# Altium schematic sheet ESP32.SchDoc: WiFi Bluetooth and Peripheral (part 1 of 2)
size A3; DrawnBy: Manh Ngo Van; Engineer: Manh Ngo Van; Organization: Altium Limited; Address1: L3, 12a Rodborough Rd; Address2: Frenchs Forest; Address3: NSW; Address4: Australia 2086; DocumentNumber: 3; Revision: 1.0; SheetNumber: 3; SheetTotal: 3
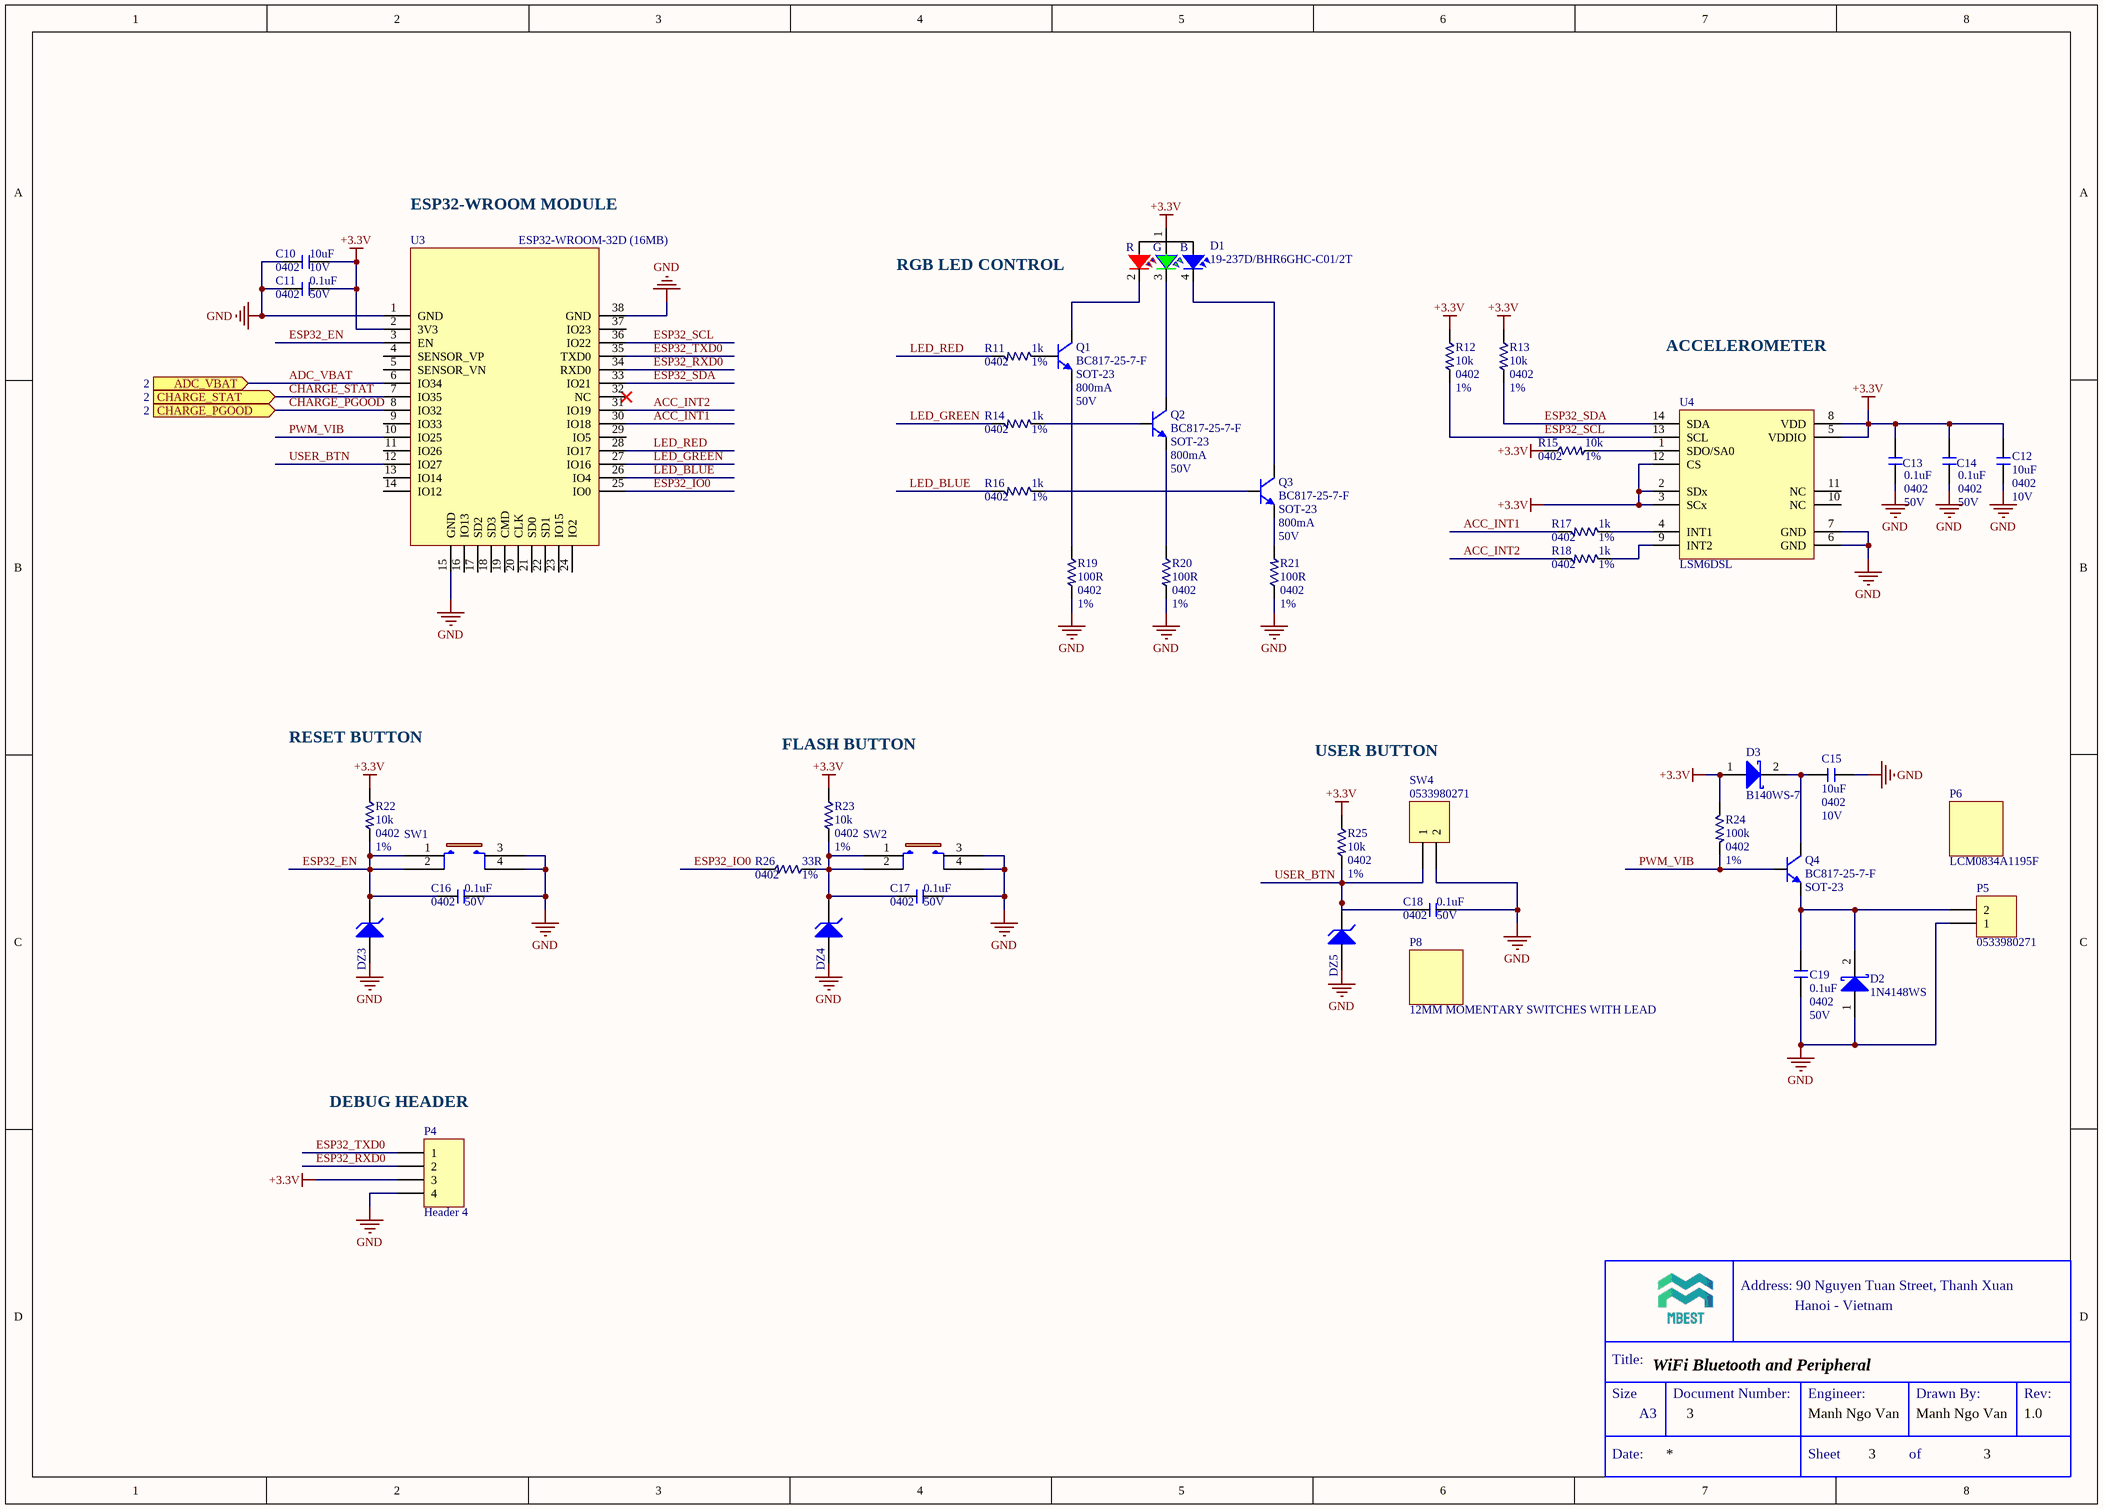
[diagram p0: ESP32.SchDoc]

## Parts
C10  10uF  Case/Package: 0402  Voltage Rating: 10V  [C0402M]
C11  0.1uF  Case/Package: 0402  Voltage: 50V  [C0402M]
C12  10uF  Case/Package: 0402  Voltage Rating: 10V  [C0402M]
C13  0.1uF  Case/Package: 0402  Voltage: 50V  [C0402M]
C14  0.1uF  Case/Package: 0402  Voltage: 50V  [C0402M]
C15  10uF  Case/Package: 0402  Voltage Rating: 10V  [C0402M]
C16  0.1uF  Case/Package: 0402  Voltage: 50V  [C0402M]
C17  0.1uF  Case/Package: 0402  Voltage: 50V  [C0402M]
C18  0.1uF  Case/Package: 0402  Voltage: 50V  [C0402M]
C19  0.1uF  Case/Package: 0402  Voltage: 50V  [C0402M]
D1  19-237D/BHR6GHC-C01/2T  [19-237D/BHR6GHC-C01/2T]
D2  1N4148WS  [SODFL250X70-2N]
D3  B140WS-7  [SODFL250X70-2N]
DZ3  TPD1E10B06DPYR  [R0402M]  (value not drawn)
DZ4  TPD1E10B06DPYR  [R0402M]  (value not drawn)
DZ5  TPD1E10B06DPYR  [R0402M]  (value not drawn)
P4  Header 4  [HDR1X4]
P5  0533980271  [0533980271]  (no BOM)
P6  LCM0834A1195F  (mechanical)
P8  12MM MOMENTARY SWITCHES WITH LEAD  (mechanical)
Q1  BC817-25-7-F  Case/Package: SOT-23  Max Collector Current: 800mA  Collector Base Voltage (VCBO): 50V  [SOT95P245X110-3N]
Q2  BC817-25-7-F  Case/Package: SOT-23  Max Collector Current: 800mA  Collector Base Voltage (VCBO): 50V  [SOT95P245X110-3N]
Q3  BC817-25-7-F  Case/Package: SOT-23  Max Collector Current: 800mA  Collector Base Voltage (VCBO): 50V  [SOT95P245X110-3N]
Q4  BC817-25-7-F  Case/Package: SOT-23  [SOT95P245X110-3N]
R11  1k  Case/Package: 0402  Tolerance: 1%  [R0402M]
R12  10k  Case Code (Imperial): 0402  Tolerance: 1%  [R0402M]
R13  10k  Case Code (Imperial): 0402  Tolerance: 1%  [R0402M]
R14  1k  Case/Package: 0402  Tolerance: 1%  [R0402M]
R15  10k  Case Code (Imperial): 0402  Tolerance: 1%  [R0402M]
R16  1k  Case/Package: 0402  Tolerance: 1%  [R0402M]
R17  1k  Case/Package: 0402  Tolerance: 1%  [R0402M]
R18  1k  Case/Package: 0402  Tolerance: 1%  [R0402M]
R19  100R  Case Code (Imperial): 0402  Tolerance: 1%  [R0402M]
R20  100R  Case Code (Imperial): 0402  Tolerance: 1%  [R0402M]
R21  100R  Case Code (Imperial): 0402  Tolerance: 1%  [R0402M]
R22  10k  Case Code (Imperial): 0402  Tolerance: 1%  [R0402M]
R23  10k  Case Code (Imperial): 0402  Tolerance: 1%  [R0402M]
R24  100k  Case/Package: 0402  Tolerance: 1%  [R0402M]
R25  10k  Case Code (Imperial): 0402  Tolerance: 1%  [R0402M]
R26  33R  Size Code: 0402  Tolerance: 1%  [R0402M]
SW1  PTS810SJK250SMTRLFS  [PTS810SJG250SMTRLFS]  (value not drawn)
SW2  PTS810SJK250SMTRLFS  [PTS810SJG250SMTRLFS]  (value not drawn)
SW4  0533980271  [0533980271]  (no BOM)
U3  ESP32-WROOM-32D (16MB)  [ESP32S]
U4  LSM6DSL  [LSM6DSL]

## Ports
ADC_VBAT (in, see 2), CHARGE_PGOOD (in, see 2), CHARGE_STAT (in, see 2)

## Nets
+3.3V: C10.2 C11.2 C12.2 C13.2 C14.2 D1.1(ANODE) D3.1(A) P4.3 R12.2 R13.2 R15.2 R22.2 R23.2 R24.2 R25.2 U3.2(3V3) U4.2(SDx) U4.3(SCx) U4.5(VDDIO) U4.8(VDD) U4.12(CS)
GND: C10.1 C11.1 C12.1 C13.1 C14.1 C15.1 C16.2 C17.2 C18.2 C19.1 D2.1(A) DZ3.1(A) DZ4.1(A) DZ5.1(A) P4.4 P5.1 R19.1 R20.1 R21.2 SW1.3 SW1.4 SW2.3 SW2.4 SW4.2 U3.1(GND) U3.15(GND) U3.38(GND) U4.6(GND) U4.7(GND)
ACC_INT1: R17.1 U3.30(IO18)
ACC_INT2: R18.1 U3.31(IO19)
ADC_VBAT: U3.6(IO34) ; port ADC_VBAT
CHARGE_PGOOD: U3.8(IO32) ; port CHARGE_PGOOD
CHARGE_STAT: U3.7(IO35) ; port CHARGE_STAT
ESP32_EN: C16.1 DZ3.2(K) R22.1 SW1.1 SW1.2 U3.3(EN)
ESP32_IO0: R26.1 U3.25(IO0)
ESP32_RXD0: P4.2 U3.34(RXD0)
ESP32_SCL: R12.1 U3.36(IO22) U4.13(SCL)
ESP32_SDA: R13.1 U3.33(IO21) U4.14(SDA)
ESP32_TXD0: P4.1 U3.35(TXD0)
LED_BLUE: R16.1 U3.26(IO4)
LED_GREEN: R14.1 U3.27(IO16)
LED_RED: R11.1 U3.28(IO17)
PWM_VIB: Q4.1(B) R24.1 U3.10(IO25)
USER_BTN: C18.1 DZ5.2(K) R25.1 SW4.1 U3.12(IO27)
NetC15_2: C15.2 D3.2(K) Q4.3(C)
NetC17_1: C17.1 DZ4.2(K) R23.1 R26.2 SW2.1 SW2.2
NetC19_2: C19.2 D2.2(K) P5.2 Q4.2(E)
NetD1_2: D1.2(R) Q1.3(C)
NetD1_3: D1.3(G) Q2.3(C)
NetD1_4: D1.4(B) Q3.3(C)
NetQ1_1: Q1.1(B) R11.2
NetQ1_2: Q1.2(E) R19.2
NetQ2_1: Q2.1(B) R14.2
NetQ2_2: Q2.2(E) R20.2
NetQ3_1: Q3.1(B) R16.2
NetQ3_2: Q3.2(E) R21.1
NetR15_1: R15.1 U4.1(SDO/SA0)
NetR17_2: R17.2 U4.4(INT1)
NetR18_2: R18.2 U4.9(INT2)

Not connected (* = marked no-connect by the designer): U3 4(SENSOR_VP) 5(SENSOR_VN) 9(IO33) 11(IO26) 13(IO14) 14(IO12) 16(IO13) 17(SD2) 18(SD3) 19(CMD) 20(CLK) 21(SD0) 22(SD1) 23(IO15) 24(IO2) 29(IO5) 32(NC)* 37(IO23); U4 10(NC) 11(NC)

## Notes on the sheet
- ESP32-WROOM MODULE
- RGB LED CONTROL
- ACCELEROMETER
- RESET BUTTON
- (near R23) FLASH BUTTON
- USER BUTTON
- (near P4) DEBUG HEADER
- Address: 90 Nguyen Tuan Street, Thanh Xuan
- Hanoi - Vietnam
- Title:
- Size
- Document Number:
- Engineer:
- Drawn By:
- Rev:
- Date:
- A3
- Sheet
- of